# Altium schematic sheet Top.SchDoc
size B; Author: E. Sims; Organization: Let's Build Rockets Inc.; SheetNumber: 1; SheetTotal: 2
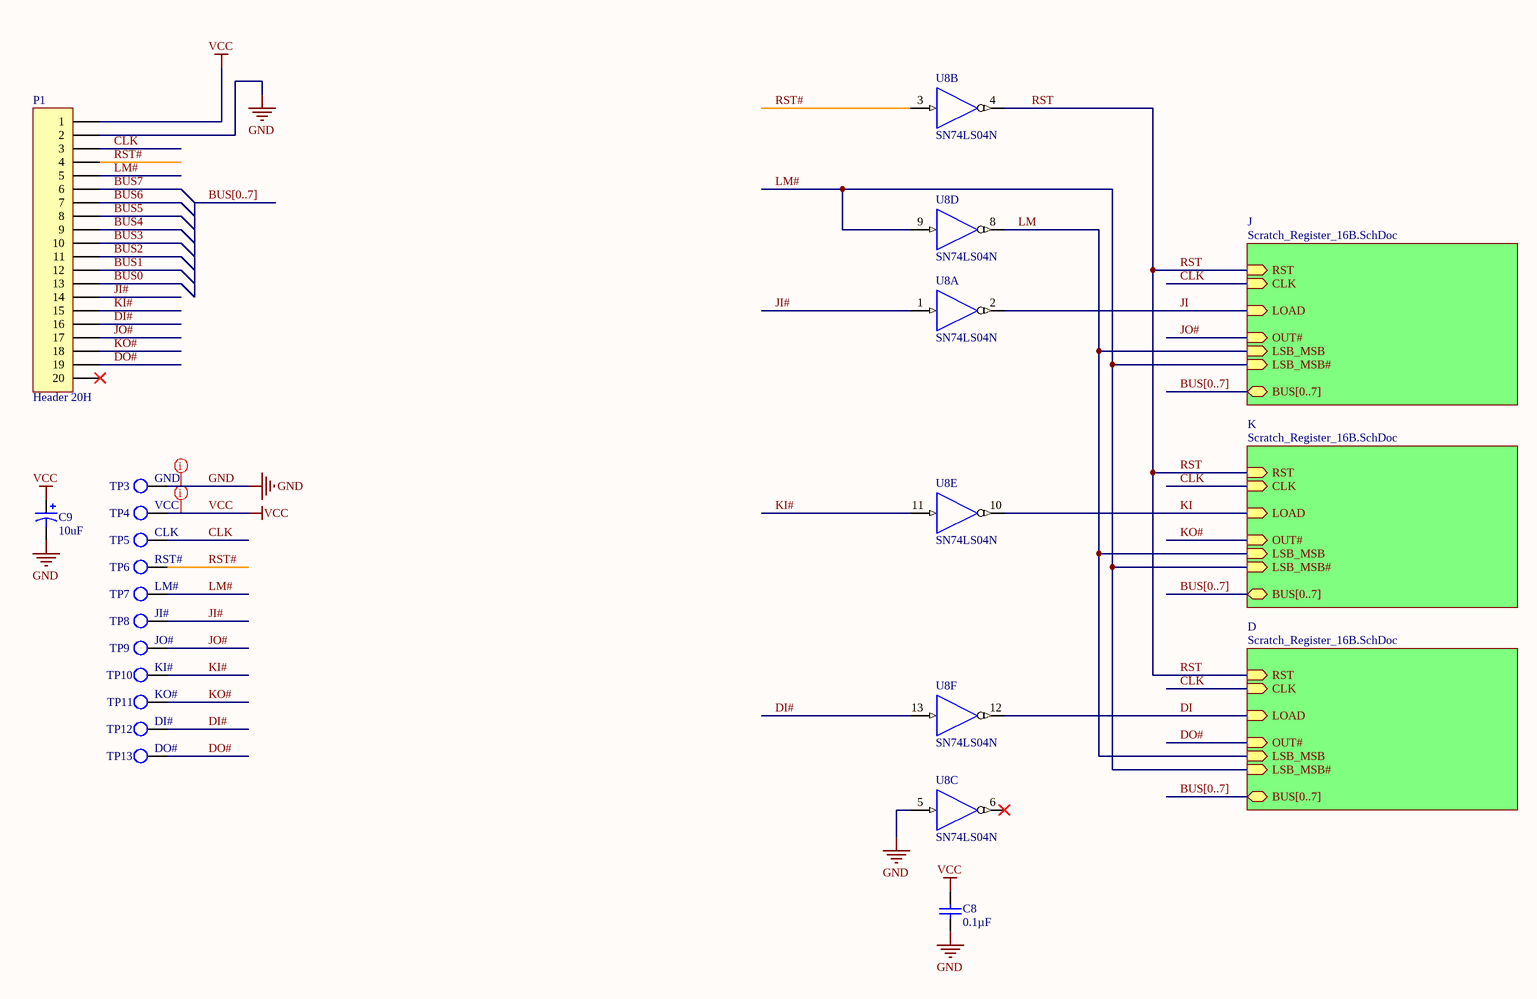
[diagram p0: Top.SchDoc]

## Parts
C8  Capacitance: 0.1µF  [VISH-K104K15X7RF5TL2]  (hidden comment: K104K15X7RF5TL2)
C9  value 10uF  [C5x7]  (hidden comment: Cap Pol5)
P1  Header 20H  [HDR1X20H]
TP3  GND  [KSTN-5011_V]  (no BOM)
TP4  VCC  [KSTN-5011_V]  (no BOM)
TP5  CLK  [KSTN-5011_V]  (no BOM)
TP6  RST#  [KSTN-5011_V]  (no BOM)
TP7  LM#  [KSTN-5011_V]  (no BOM)
TP8  JI#  [KSTN-5011_V]  (no BOM)
TP9  JO#  [KSTN-5011_V]  (no BOM)
TP10  KI#  [KSTN-5011_V]  (no BOM)
TP11  KO#  [KSTN-5011_V]  (no BOM)
TP12  DI#  [KSTN-5011_V]  (no BOM)
TP13  DO#  [KSTN-5011_V]  (no BOM)
U8  SN74LS04N  [N014]  (parts A,B,C,D,E,F of 6)

## Sub-sheets
D = Scratch_Register_16B.SchDoc: RST (in), BUS[0..7] (bidir), CLK (in), OUT# (in), LSB_MSB (in), LOAD (in), LSB_MSB# (in)
J = Scratch_Register_16B.SchDoc: RST (in), BUS[0..7] (bidir), CLK (in), OUT# (in), LSB_MSB (in), LOAD (in), LSB_MSB# (in)
K = Scratch_Register_16B.SchDoc: RST (in), BUS[0..7] (bidir), CLK (in), OUT# (in), LSB_MSB (in), LOAD (in), LSB_MSB# (in)

## Nets
GND: C8.2 C9.2 P1.2 TP3.1 U8.5(A) U8.7(GND)
VCC: C8.1 C9.1 P1.1 TP4.1 U8.14(VCC)
BUS0: P1.13
BUS1: P1.12
BUS2: P1.11
BUS3: P1.10
BUS4: P1.9
BUS5: P1.8
BUS6: P1.7
BUS7: P1.6
CLK: P1.3 TP5.1 ; sheet D/CLK, sheet K/CLK, sheet J/CLK
DI: U8.12(Y) ; sheet D/LOAD
DI#: P1.16 TP12.1 U8.13(A)
DO#: P1.19 TP13.1 ; sheet D/OUT#
JI: U8.2(Y) ; sheet J/LOAD
JI#: P1.14 TP8.1 U8.1(A)
JO#: P1.17 TP9.1 ; sheet J/OUT#
KI: U8.10(Y) ; sheet K/LOAD
KI#: P1.15 TP10.1 U8.11(A)
KO#: P1.18 TP11.1 ; sheet K/OUT#
LM: U8.8(Y) ; sheet D/LSB_MSB, sheet K/LSB_MSB, sheet J/LSB_MSB
LM#: P1.5 TP7.1 U8.9(A) ; sheet D/LSB_MSB#, sheet K/LSB_MSB#, sheet J/LSB_MSB#
RST: U8.4(Y) ; sheet D/RST, sheet K/RST, sheet J/RST
RST#: P1.4 TP6.1 U8.3(A)

Not connected (* = marked no-connect by the designer): P1 20*; U8 6(Y)*

## Buses and harness runs
bus BUS[0..7]
bus BUS[0..7] = sheet D/BUS[0..7]
bus BUS[0..7] = sheet J/BUS[0..7]
bus BUS[0..7] = sheet K/BUS[0..7]

## Layout directives
rule Width Constraint [Pref Width = 20mil    Min Width = 20mil    Max Width = 50mil]; rule Routing Via Style [Pref Size = 35mil    Pref Hole Size = 20mil]; net class PWR: GND, VCC

## Notes on the sheet
- Let's Build Rocket's Inc. Modular Paylaod System Based on TMP-010 Rev
  For more information visit https://github.com/LetsBuildRockets/Modular-Payload-System
  This work is licensed under CC BY-NC 4.0. To view a copy of this license, visit https://creativecommons.org/licenses/by-nc/4.0
- Title
- Size:
- Date:
- Assembly Variant:
- B
- Number:
- Time:
- Revision:
- Sheet
- of
- Author:
- File:

## Library data of the parts
C8 = CMP-2000-06508-1: Ceramic Capacitor, 100 nF, +/- 10%, 50 V, -55 to 125 degC, 2-Pin THD, RoHS, Tape and Reel; Manufacturer: Vishay; Other Names: BC1084CT; Catalog Drawings: Mono-KapSide2-15_5.58Mono-KapSide1_15; Temperature Coefficient: X7R; Voltage - Rated: 50V; Online Catalog: Mono-Kap™Series; Size / Dimension: 0.157"Lx0.098"W(4.00mmx2.50mm); Operating Temperature: -55°C~125°C; Family: CeramicCapacitors; Manufacturer URL: http://www.vishay.com/; Standard Package: 1; Thickness (Max): -; Ratings: -; Datasheet Version: 08/2013; Package Description: 2-Pin Through Hole Device, Body 4 x 2.6 mm; Mounting Type: ThroughHole; Features: -; Lead Spacing: 0.098"(2.50mm); Tolerance: ±10%; Category: Capacitors; Mounting Technology: ThroughHole; Lead Style: Straight; Datasheet URL: http://www.vishay.com/docs/45171/kseries.pdf; Applications: GeneralPurpose; Package / Case: Radial; Height - Seated (Max): 0.220"(5.58mm); Package Reference: K104K15X7RF5TL2; Series: Mono-Kap™K; Packaging: CutTape(CT)
C9 = Cap Pol5: Polarized Capacitor; Published: 8-Jun-2000; LatestRevisionDate: 17-Jul-2002; LatestRevisionNote: Re-released for DXP Platform.; PackageReference: POLAR0.8; Publisher: Altium Limited; PackageDescription: Polarized Capacitor; 2 Leads
P1 = Header 20H: Header, 20-Pin, Right Angle; System: Connector; LatestRevisionDate: 17-Jul-2002; LatestRevisionNote: Re-released for DXP Platform.; Publisher: Altium Limited
TP3-TP13 = TP
U8 = SN74LS04N: Hex Inverter; Published: 8-Jun-2000; LatestRevisionDate: 04-Mar-2005; LatestRevisionNote: Stylized 3D Model Added.; DatasheetVersion: Mar-1988; PackageVersion: Oct-1995; PackageReference: N014; Publisher: Altium Limited; PackageDescription: DIP; 14 Leads; Row Spacing 7.62 mm; Pitch 2.54 mm; ComponentLink1Description: Manufacturer Link; ComponentLink1URL: http://www.ti.com/; ComponentLink2Description: Datasheet; ComponentLink2URL: http://www-s.ti.com/sc/ds/sn74ls04.pdf